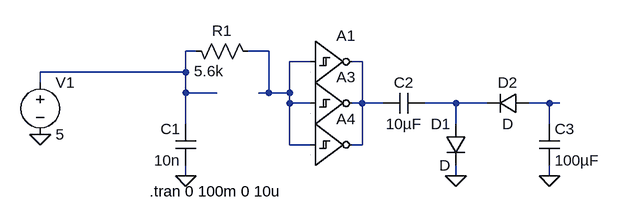
[diagram p0: schematic Draft3.asc]
Draft3.asc, the LTspice schematic file:
Version 4
SHEET 1 880 680
WIRE 112 112 96 112
WIRE 224 112 192 112
WIRE 288 128 256 128
WIRE 368 128 352 128
WIRE 96 144 96 112
WIRE 96 144 -128 144
WIRE -128 160 -128 144
WIRE 96 176 96 144
WIRE 144 176 96 176
WIRE 224 176 224 112
WIRE 224 176 208 176
WIRE 256 176 256 128
WIRE 256 176 224 176
WIRE 256 192 256 176
WIRE 288 192 256 192
WIRE 368 192 368 128
WIRE 368 192 352 192
WIRE 400 192 368 192
WIRE 512 192 464 192
WIRE 560 192 512 192
WIRE 656 192 624 192
WIRE 672 192 656 192
WIRE 96 224 96 176
WIRE 512 224 512 192
WIRE 656 224 656 192
WIRE 256 256 256 192
WIRE 288 256 256 256
WIRE 368 256 368 192
WIRE 368 256 352 256
WIRE 96 304 96 288
WIRE 512 304 512 288
WIRE 656 304 656 288
FLAG 96 304 0
FLAG 512 304 0
FLAG 656 304 0
FLAG -128 240 0
SYMBOL Digital\\schmtinv 288 64 R0
SYMATTR InstName A1
SYMBOL Digital\\schmtinv 288 128 R0
SYMATTR InstName A3
SYMBOL Digital\\schmtinv 288 192 R0
SYMATTR InstName A4
SYMBOL cap 112 224 M0
SYMATTR InstName C1
SYMATTR Value 10n
SYMBOL res 208 128 M270
WINDOW 0 32 56 VTop 2
WINDOW 3 1 76 VBottom 2
SYMATTR InstName R1
SYMATTR Value 5.6k
SYMBOL cap 464 208 M270
WINDOW 0 32 32 VTop 2
WINDOW 3 0 32 VBottom 2
SYMATTR InstName C2
SYMATTR Value 10µF
SYMBOL diode 528 224 M0
SYMATTR InstName D1
SYMBOL diode 624 208 M270
WINDOW 0 32 32 VTop 2
WINDOW 3 0 32 VBottom 2
SYMATTR InstName D2
SYMBOL cap 640 224 R0
SYMATTR InstName C3
SYMATTR Value 100µF
SYMBOL voltage -128 144 R0
WINDOW 123 0 0 Left 2
WINDOW 39 0 0 Left 2
SYMATTR InstName V1
SYMATTR Value 5
TEXT 40 328 Left 2 !.tran 0 100m 0 10u

The netlist it stands for:
* Draft3.asc
A1 N002 0 0 0 0 N003 0 0 SCHMITT
A3 N002 0 0 0 0 N003 0 0 SCHMITT
A4 N002 0 0 0 0 N003 0 0 SCHMITT
C1 N001 0 10n
R1 N002 N001 5.6k
C2 N004 N003 10µF
D1 N004 0 D
D2 N005 N004 D
C3 N005 0 100µF
V1 N001 0 5
.model D D
.lib standard.dio
.tran 0 100m 0 10u
.backanno
.end